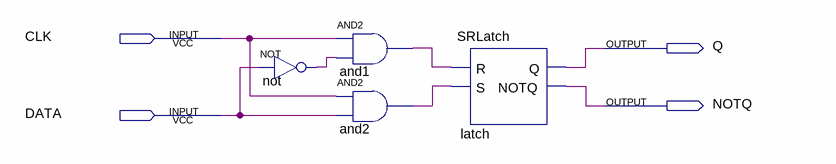
[diagram p0: schematic sheet]
// Quartus schematic DataLatch.bdf as structural Verilog: 4 symbols, 4 pins
module DataLatch (
  input  CLK,
  input  DATA,
  output Q,
  output NOTQ
);

  wire and1_out, and2_out, not_out;

  not \not  (not_out, DATA);
  and and1 (and1_out, CLK, not_out);
  and and2 (and2_out, CLK, DATA);
  SRLatch latch (.R(and1_out), .S(and2_out), .Q(Q), .NOTQ(NOTQ));
endmodule
